# Altium schematic sheet DRV8301_1.SchDoc
size A3
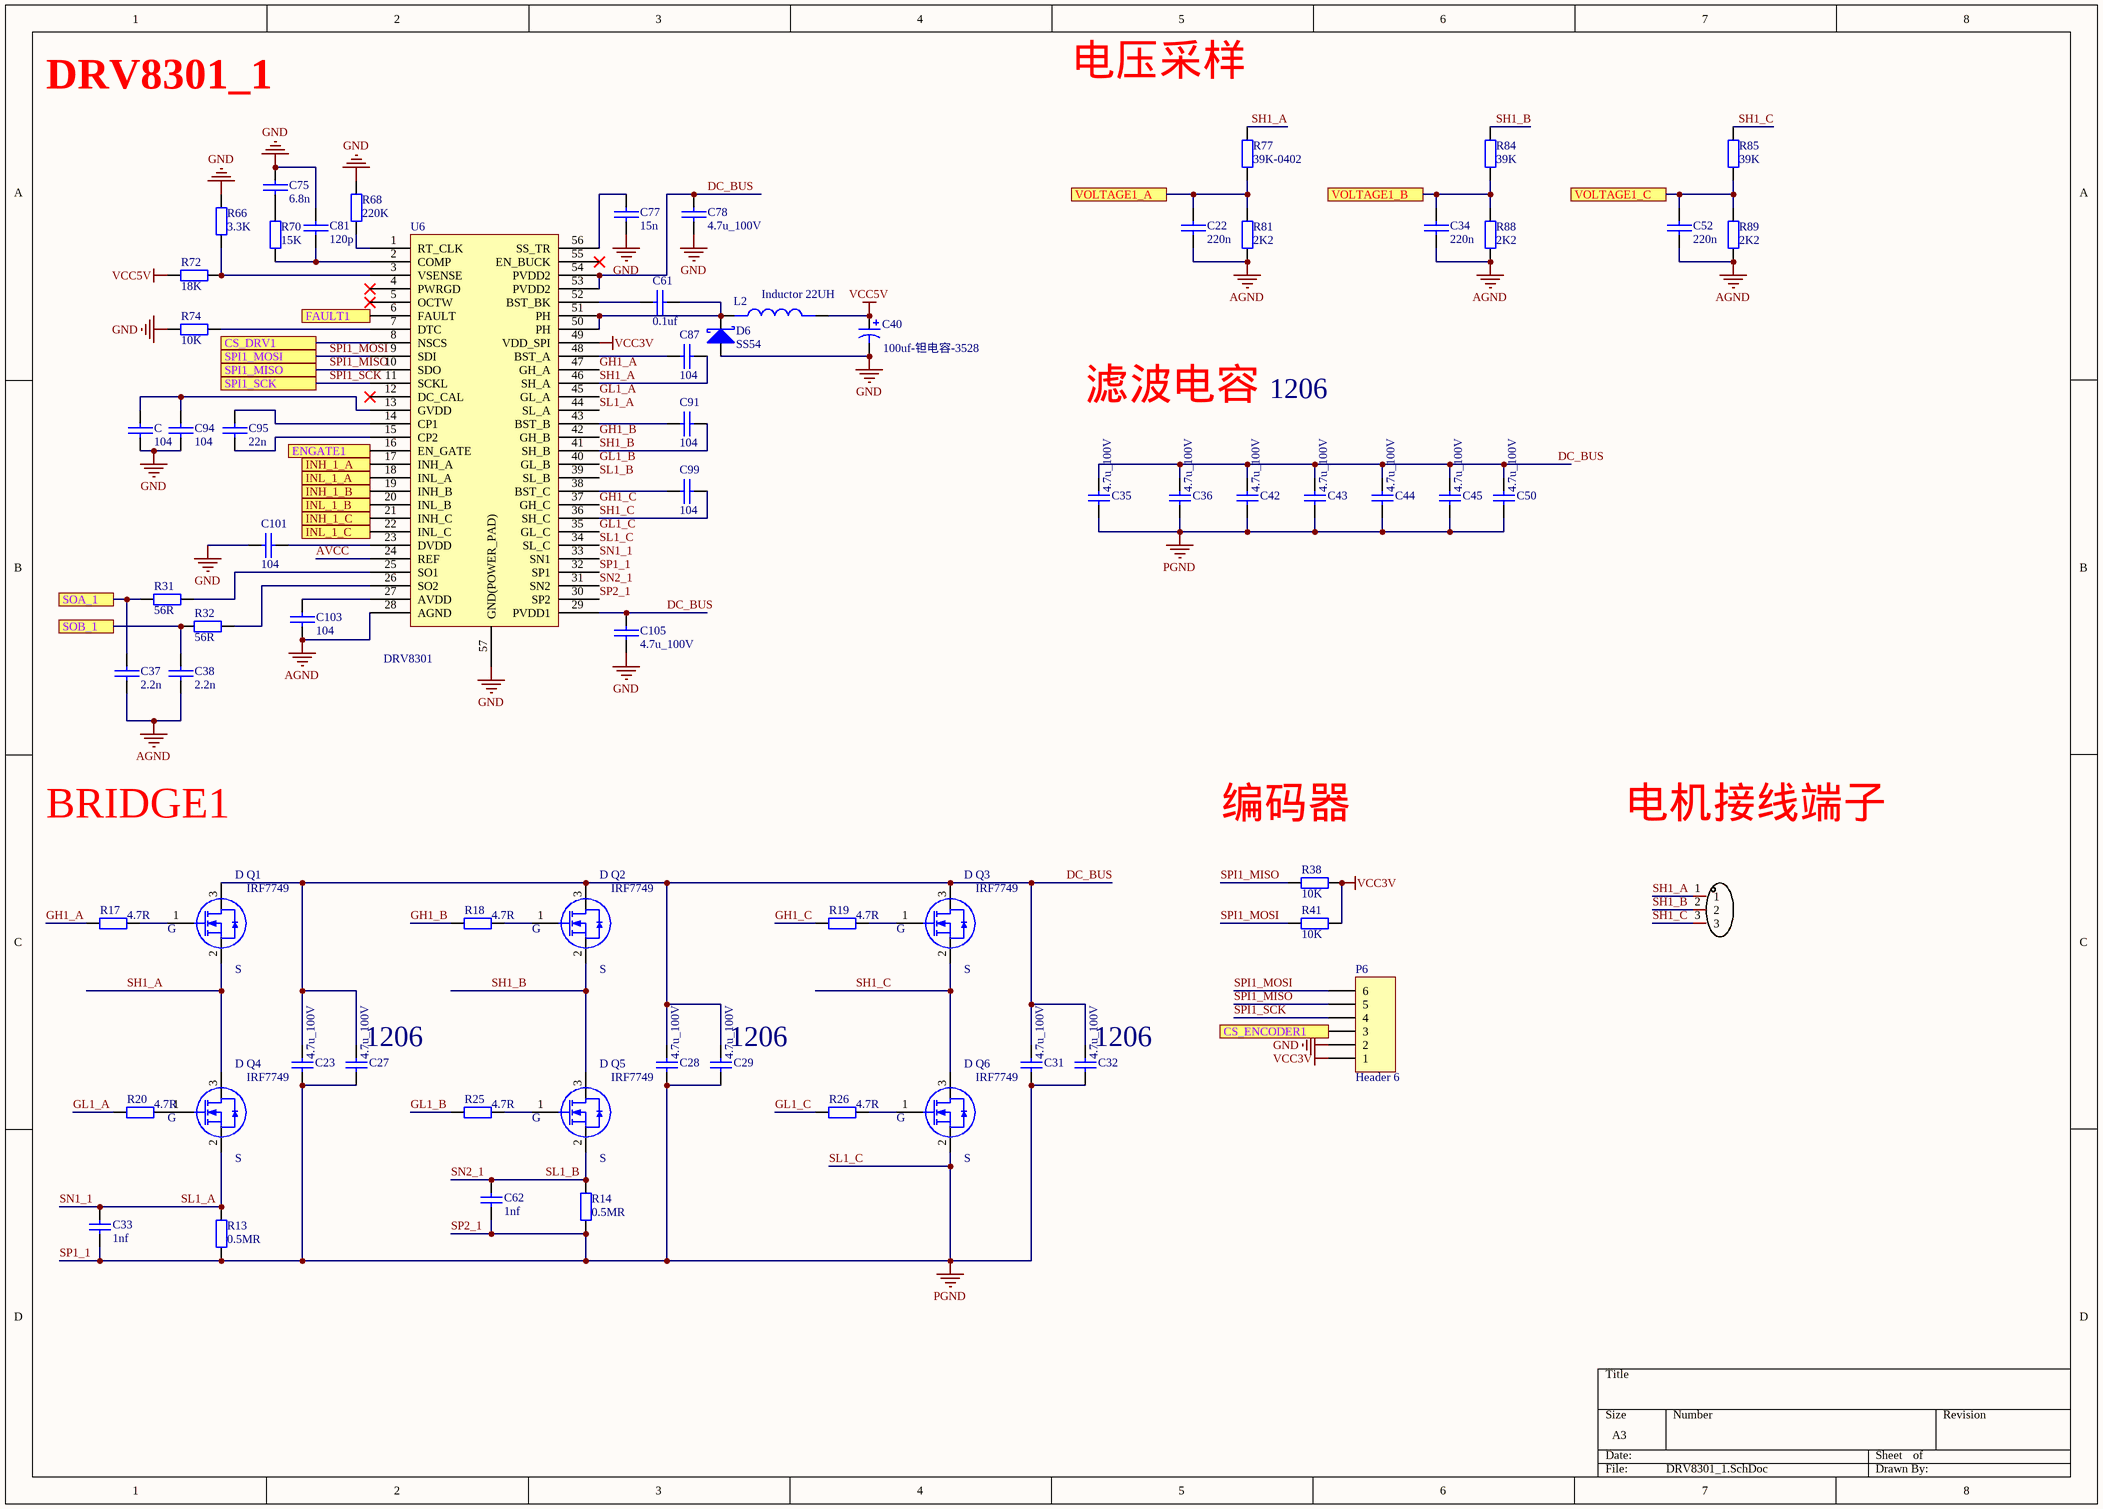
[diagram p0: DRV8301_1.SchDoc]

## Parts
C  value 104  [0402C]  (hidden comment: CAP)
C22  value 220n  [0402C]  (hidden comment: CAP)
C23  value 4.7u_100V  [1206_C]  (hidden comment: Cap)
C27  value 4.7u_100V  [1206_C]  (hidden comment: Cap)
C28  value 4.7u_100V  [1206_C]  (hidden comment: Cap)
C29  value 4.7u_100V  [1206_C]  (hidden comment: Cap)
C31  value 4.7u_100V  [1206_C]  (hidden comment: Cap)
C32  value 4.7u_100V  [1206_C]  (hidden comment: Cap)
C33  value 1nf  [0402C]  (hidden comment: Cap)
C34  value 220n  [0402C]  (hidden comment: CAP)
C35  value 4.7u_100V  [1206_C]  (hidden comment: Cap)
C36  value 4.7u_100V  [1206_C]  (hidden comment: Cap)
C37  value 2.2n  [0402C]  (hidden comment: CAP)
C38  value 2.2n  [0402C]  (hidden comment: CAP)
C40  value 100uf-钽电容-3528  [CAP-SMD_L3.5-W2.8-R-RD]  (hidden comment: CAP_HER)
C42  value 4.7u_100V  [1206_C]  (hidden comment: Cap)
C43  value 4.7u_100V  [1206_C]  (hidden comment: Cap)
C44  value 4.7u_100V  [1206_C]  (hidden comment: Cap)
C45  value 4.7u_100V  [1206_C]  (hidden comment: Cap)
C50  value 4.7u_100V  [1206_C]  (hidden comment: Cap)
C52  value 220n  [0402C]  (hidden comment: CAP)
C61  value 0.1uf  [0402C]  (hidden comment: CAP)
C62  value 1nf  [0402C]  (hidden comment: Cap)
C75  value 6.8n  [0402C]  (hidden comment: CAP)
C77  value 15n  [0402C]  (hidden comment: CAP)
C78  value 4.7u_100V  [0603_C]  (hidden comment: CAP)
C81  value 120p  [0402C]  (hidden comment: CAP)
C87  value 104  [0402C]  (hidden comment: CAP)
C91  value 104  [0402C]  (hidden comment: CAP)
C94  value 104  [0402C]  (hidden comment: CAP)
C95  value 22n  [0402C]  (hidden comment: CAP)
C99  value 104  [0402C]  (hidden comment: CAP)
C101  value 104  [0402C]  (hidden comment: CAP)
C103  value 104  [0402C]  (hidden comment: CAP)
C105  value 4.7u_100V  [0603_C]  (hidden comment: CAP)
D6  SS54  [DIODE_3*5.3]
L2  Inductor 22UH  [IND-SMD_L5.0-W5.0]
P6  Header 6  [A1002WR-S-6P]
Q1  IRF7749  [IRF7480]
Q2  IRF7749  [IRF7480]
Q3  IRF7749  [IRF7480]
Q4  IRF7749  [IRF7480]
Q5  IRF7749  [IRF7480]
Q6  IRF7749  [IRF7480]
R13  value 0.5MR  [0.5mr_6W]  (hidden comment: Res1)
R14  value 0.5MR  [0.5mr_6W]  (hidden comment: Res1)
R17  value 4.7R  [0402R]  (hidden comment: Res1)
R18  value 4.7R  [0402R]  (hidden comment: Res1)
R19  value 4.7R  [0402R]  (hidden comment: Res1)
R20  value 4.7R  [0402R]  (hidden comment: Res1)
R25  value 4.7R  [0402R]  (hidden comment: Res1)
R26  value 4.7R  [0402R]  (hidden comment: Res1)
R31  56R  [0402R]
R32  56R  [0402R]
R38  10K  [0402R]
R41  10K  [0402R]
R66  3.3K  [0402R]
R68  220K  [0402R]
R70  15K  [0402R]
R72  18K  [0402R]
R74  10K  [0402R]
R77  39K-0402  [0402R]
R81  2K2  [0402R]
R84  39K  [0402R]
R85  39K  [0402R]
R88  2K2  [0402R]
R89  2K2  [0402R]
U6  DRV8301  [HTSSOP-56_L14.0-W6.0-P0.50-LS8.0-BL]
U7  MR30-M  [MR30-M-SMD]  (value not drawn)

## Ports
CS_DRV1, CS_ENCODER1, ENGATE1, FAULT1, INH_1_A, INH_1_B, INH_1_C, INL_1_A, INL_1_B, INL_1_C, SOA_1, SOB_1, SPI1_MISO, SPI1_MOSI, SPI1_SCK, VOLTAGE1_A, VOLTAGE1_B, VOLTAGE1_C

## Nets
AGND: C22.2 C34.2 C37.1 C38.1 C52.2 C103.1 R81.2 R88.2 R89.2 U6.28(AGND)
GND: C.1 C40.2 C75.2 C77.1 C78.1 C81.2 C94.1 C101.1 C105.1 D6.1(A) P6.2 R66.2 R68.2 R74.1 U6.57(GND(POWER_PAD))
SL1_C: C23.1 C27.1 C28.1 C29.1 C31.1 C32.1 C33.1 C35.1 C36.1 C42.1 C43.1 C44.1 C45.1 C50.1 C62.1 Q6.2(S) R13.1 R14.1 U6.30(SP2) U6.32(SP1) U6.34(SL_C)  [also labelled PGND, SP1_1, SP2_1]
VCC3V: P6.1 R38.2 R41.2 U6.49(VDD_SPI)
VCC5V: C40.1 L2.2(Pri-) R72.1
AVCC: U6.24(REF)
CS_DRV1: U6.8(NSCS) ; port CS_DRV1
CS_ENCODER1: P6.3 ; port CS_ENCODER1
DC_BUS: C23.2 C27.2 C28.2 C29.2 C31.2 C32.2 C35.2 C36.2 C42.2 C43.2 C44.2 C45.2 C50.2 C78.2 C105.2 Q1.3(D) Q2.3(D) Q3.3(D) U6.29(PVDD1) U6.53(PVDD2) U6.54(PVDD2)
ENGATE1: U6.16(EN_GATE) ; port ENGATE1
FAULT1: U6.6(FAULT) ; port FAULT1
GH1_A: R17.1 U6.47(GH_A)
GH1_B: R18.1 U6.42(GH_B)
GH1_C: R19.1 U6.37(GH_C)
GL1_A: R20.1 U6.45(GL_A)
GL1_B: R25.1 U6.40(GL_B)
GL1_C: R26.1 U6.35(GL_C)
INH_1_A: U6.17(INH_A) ; port INH_1_A
INH_1_B: U6.19(INH_B) ; port INH_1_B
INH_1_C: U6.21(INH_C) ; port INH_1_C
INL_1_A: U6.18(INL_A) ; port INL_1_A
INL_1_B: U6.20(INL_B) ; port INL_1_B
INL_1_C: U6.22(INL_C) ; port INL_1_C
SH1_A: C87.1 Q1.2(S) Q4.3(D) R77.2 U6.46(SH_A) U7.1
SH1_B: C91.1 Q2.2(S) Q5.3(D) R84.2 U6.41(SH_B) U7.2
SH1_C: C99.1 Q3.2(S) Q6.3(D) R85.2 U6.36(SH_C) U7.3
SL1_A: C33.2 Q4.2(S) R13.2 U6.33(SN1) U6.44(SL_A)  [also labelled SN1_1]
SL1_B: C62.2 Q5.2(S) R14.2 U6.31(SN2) U6.39(SL_B)  [also labelled SN2_1]
SOA_1: C37.2 R31.1 ; port SOA_1
SOB_1: C38.2 R32.1 ; port SOB_1
SPI1_MISO: P6.5 R38.1 U6.10(SDO) ; port SPI1_MISO
SPI1_MOSI: P6.6 R41.1 U6.9(SDI) ; port SPI1_MOSI
SPI1_SCK: P6.4 U6.11(SCKL) ; port SPI1_SCK
VOLTAGE1_A: C22.1 R77.1 R81.1 ; port VOLTAGE1_A
VOLTAGE1_B: C34.1 R84.1 R88.1 ; port VOLTAGE1_B
VOLTAGE1_C: C52.1 R85.1 R89.1 ; port VOLTAGE1_C
NetC61_1: C61.1 D6.2(K) L2.1(Pri-) U6.50(PH) U6.51(PH)
NetC61_2: C61.2 U6.52(BST_BK)
NetC75_1: C75.1 R70.2
NetC77_2: C77.2 U6.56(SS_TR)
NetC81_1: C81.1 R70.1 U6.2(COMP)
NetC87_2: C87.2 U6.48(BST_A)
NetC91_2: C91.2 U6.43(BST_B)
NetC95_1: C95.1 U6.14(CP1)
NetC95_2: C95.2 U6.15(CP2)
NetC99_2: C99.2 U6.38(BST_C)
NetC101_2: C101.2 U6.23(DVDD)
NetC103_2: C103.2 U6.27(AVDD)
NetC_2: C.2 C94.2 U6.13(GVDD)
NetQ1_1: Q1.1(G) R17.2
NetQ2_1: Q2.1(G) R18.2
NetQ3_1: Q3.1(G) R19.2
NetQ4_1: Q4.1(G) R20.2
NetQ5_1: Q5.1(G) R25.2
NetQ6_1: Q6.1(G) R26.2
NetR31_2: R31.2 U6.25(SO1)
NetR32_2: R32.2 U6.26(SO2)
NetR66_1: R66.1 R72.2 U6.3(VSENSE)
NetR68_1: R68.1 U6.1(RT_CLK)
NetR74_2: R74.2 U6.7(DTC)

Not connected (* = marked no-connect by the designer): U6 4(PWRGD)* 5(OCTW)* 12(DC_CAL)* 55(EN_BUCK)*

## Notes on the sheet
- DRV8301_1
- 电压采样
- 滤波电容
- 1206
- BRIDGE1
- 编码器
- 电机接线端子
- (near C27) 1206
- (near C29) 1206
- (near C32) 1206

## Library data of the parts
C23 C27-C29 C31-C33 C35 C36 C42-C45 C50 C62 = Cap_6: 无极性电容; Published: 8-Jun-2000; LatestRevisionDate: 17-Jul-2002; LatestRevisionNote: Re-released for DXP Platform.; PackageReference: RAD-0.3; Publisher: Altium Limited
D6 = D Schottky: Schottky Diode; Published: 8-Jun-2000; LatestRevisionDate: 17-Jul-2002; LatestRevisionNote: Re-released for DXP Platform.; PackageReference: SMB; Publisher: Altium Limited; PackageDescription: DO-214-AA/SMB; 2 C-Bend Leads; Body 5.3 x 3.6 mm, inc. leads (LxW); Code_JEDEC: DO-214-AA
L2 = IND
P6 = Header 6: Header, 6-Pin; LatestRevisionDate: 17-Jul-2002; LatestRevisionNote: Re-released for DXP Platform.; Publisher: Altium Limited
Q1-Q6 = IRF7749: MOS(场效应管)
R13 R14 R17-R20 R25 R26 = Res1: 贴片电阻; Published: 8-Jun-2000; LatestRevisionDate: 17-Jul-2002; LatestRevisionNote: Re-released for DXP Platform.; PackageReference: AXIAL-0.4; Publisher: Altium Limited
R31 R32 R66 R68 R70 R72 R77 R81 R84 R85 R88 R89 = Res2: Resistor; Value: 10K; Published: 8-Jun-2000; LatestRevisionDate: 17-Jul-2002; LatestRevisionNote: Re-released for DXP Platform.; PackageReference: AXIAL-0.4; Publisher: Altium Limited; PackageDescription: Axial Device, Thru-Hole; 2 Leads; 0.4 in Pin Spacing
R38 R41 R74 = Res2: Resistor; Published: 8-Jun-2000; LatestRevisionDate: 17-Jul-2002; LatestRevisionNote: Re-released for DXP Platform.; PackageReference: AXIAL-0.4; Publisher: Altium Limited; PackageDescription: Axial Device, Thru-Hole; 2 Leads; 0.4 in Pin Spacing; Value: 10K
U6 = DRV8301: 三相整流桥芯片
U7 = MR30-M: Manufacturer: AMASS(艾迈斯); Add into BOM: yes; Name: MR30-M; Symbol: MR30-M; Device: MR30-M; LCSC Part Name: MR30-M 两件套; Supplier Part: C99873; Manufacturer Part: MR30-M; Supplier Footprint: -; JLCPCB Part Class: Extended Part; Datasheet: https://atta.szlcsc.com/upload/public/pdf/source/20170412/1491969315720.pdf; Supplier: LCSC; Convert to PCB: yes